# Altium schematic sheet Sheet1.SchDoc
size A; SheetNumber: 1; SheetTotal: 1
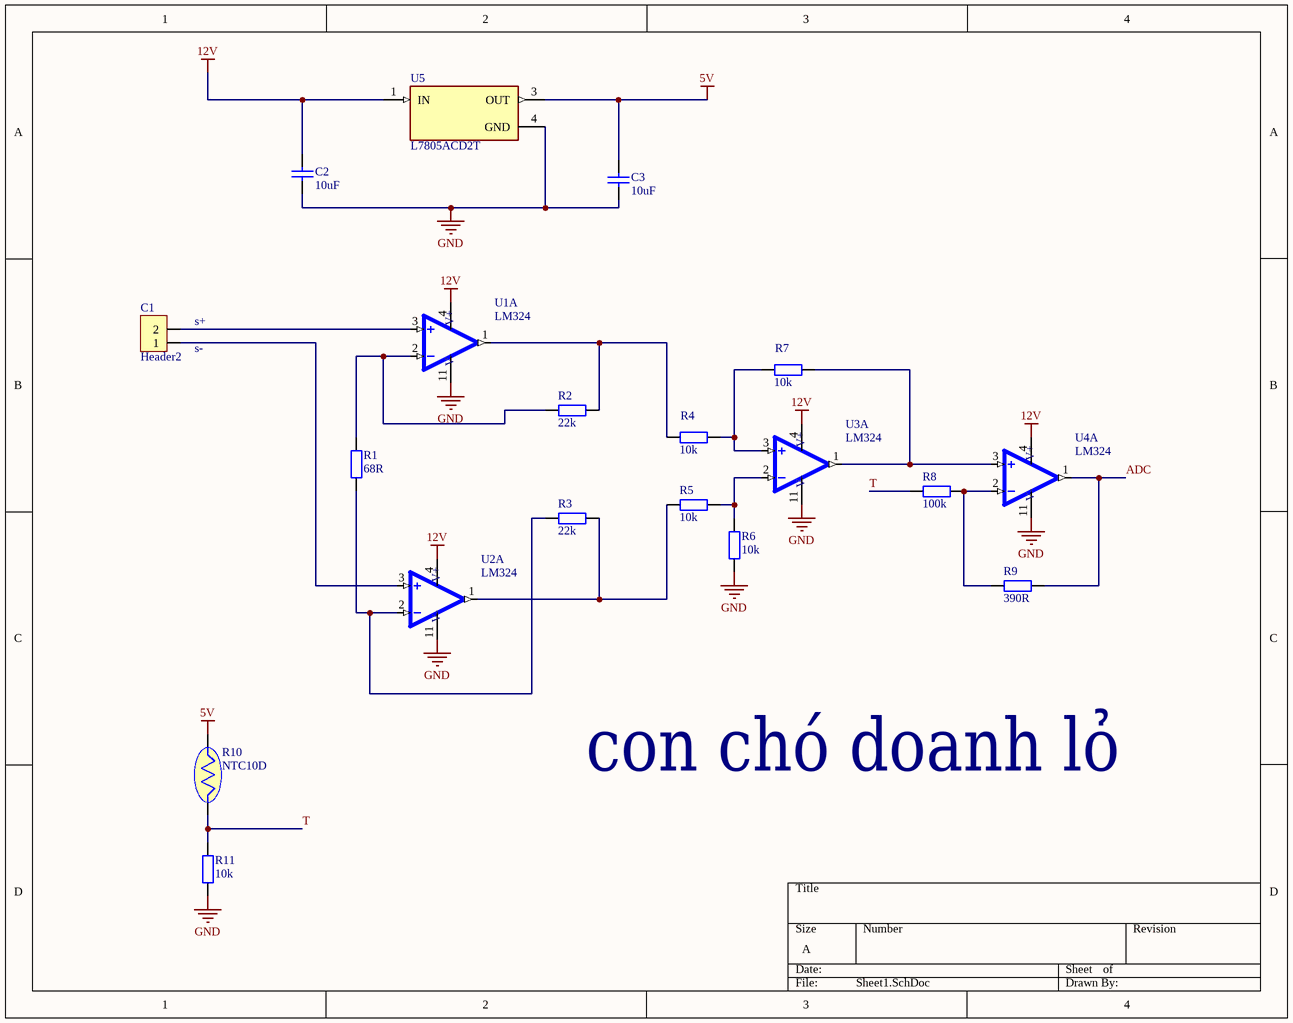
[diagram p0: Sheet1.SchDoc]

## Parts
C1  Header2  [HDR2]
C2  10uF  [tu 0805]
C3  10uF  [tu 0805]
R1  68R  [Tro SMD 0805]
R2  22k  [tro smd 0805]
R3  22k  [tro smd 0805]
R4  10k  [tro smd 0805]
R5  10k  [tro smd 0805]
R6  10k  [tro smd 0805]
R7  10k  [tro smd 0805]
R8  100k  [tro smd 0805]
R9  390R  [Tro SMD 0805]
R10  NTC10D  [NTC10D]
R11  10k  [tro smd 0805]
U1  LM324  [SOIC127P600X175-14N]  (part A of 4)
U2  LM324  [SOIC127P600X175-14N]  (part A of 4)
U3  LM324  [SOIC127P600X175-14N]  (part A of 4)
U4  LM324  [SOIC127P600X175-14N]  (part A of 4)
U5  L7805ACD2T  [VREG_L7805ACD2T]

## Nets
5V: C3.1 R10.2 U5.3(OUT)
12V: C2.1 U1.4(VCC+) U2.4(VCC+) U3.4(VCC+) U4.4(VCC+) U5.1(IN)
GND: C2.2 C3.2 R6.1 R11.1 U1.11(VCC-) U2.11(VCC-) U3.11(VCC-) U4.11(VCC-) U5.4(GND)
ADC: R9.2 U4.1(OUTPUT1)
T: R8.1 R10.1 R11.2
NetC1_1: C1.1 U2.3(NON-INVERTING_INPUT1)
NetC1_2: C1.2 U1.3(NON-INVERTING_INPUT1)
NetR1_1: R1.1 R3.1 U2.2(INVERTING_INPUT1)
NetR1_2: R1.2 R2.1 U1.2(INVERTING_INPUT1)
NetR2_2: R2.2 R4.1 U1.1(OUTPUT1)
NetR3_2: R3.2 R5.1 U2.1(OUTPUT1)
NetR4_2: R4.2 R7.1 U3.3(NON-INVERTING_INPUT1)
NetR5_2: R5.2 R6.2 U3.2(INVERTING_INPUT1)
NetR7_2: R7.2 U3.1(OUTPUT1) U4.3(NON-INVERTING_INPUT1)
NetR8_2: R8.2 R9.1 U4.2(INVERTING_INPUT1)

## Notes on the sheet
- (near C1) s+
- (near C1) s-
- con chó doanh lỏ
- (in symbol LM324, part A) V+; V-

## Library data of the parts
C1 = Header2: Header IDC, 2 x 1 Pin Vertical 2.54mm Pitch (Non-Boxed, Male); Manufacturer: W¨¹rth Elektronik eiSos GmbH; partNo: 613002143121; ComponentLink1 Description: Manufacturer; ComponentLink2 Description: Datasheet; NoPins: 02; Created Date: 29 March 2013; ComponentLink1URL: http://www.we-online.com; ComponentLink2URL: http://katalog.we-online.de/em/datasheet/6130xx143121.pdf; Created by: Karrer Zheng
C2 C3 = Tu 0805 221 50V: Dán; Don_Vi: Con; So_Chan: 2; Ten_Linh_Kien: Tụ 0805 221-220P 50V; Ma_Hang: MH007365; Chung_Loai: Dán; Kieu_Chan: *
R1 = Tro 0805 5% 68R: Dán; Don_Vi: Con; So_Chan: 2; Ten_Linh_Kien: Trở 0805 5% 68R; Ma_Hang: MH005326; Chung_Loai: Dán; Kieu_Chan: *
R2 R3 = Tro 0805 5% 22k: Dán; Don_Vi: Con; So_Chan: 2; Ten_Linh_Kien: Trở 0805 5% 22k; Ma_Hang: MH005248; Chung_Loai: Dán; Kieu_Chan: *
R4-R7 R11 = Tro 0805 5% 10k: Dán; Don_Vi: Con; So_Chan: 2; Ten_Linh_Kien: Trở 0805 5% 10k; Ma_Hang: MH005239; Chung_Loai: Dán; Kieu_Chan: *
R8 = Tro 0805 5% 100k: Dán; Don_Vi: Con; So_Chan: 2; Ten_Linh_Kien: Trở 0805 5% 100k; Ma_Hang: MH005250; Chung_Loai: Dán; Kieu_Chan: *
R9 = Tro 0805 5% 390R: Dán; Don_Vi: Con; So_Chan: 2; Ten_Linh_Kien: Trở 0805 5% 390R; Ma_Hang: MH005339; Chung_Loai: Dán; Kieu_Chan: *
U1-U4 = LM324: Op Amp Quad DÃ¼ÅŸÃ¼k VoltajlÄ± AmplifikatÃ¶r Â±2.75V/5.5V 14-Pin SOIC T/R; MF: Intersil; MP: LM324..; SnapEDA_Link: https://www.snapeda.com/parts/LM324../Intersil/view-part/?ref=snap; Package: None; Value: *; Check_prices: https://www.snapeda.com/parts/LM324../Intersil/view-part/?ref=eda
U5 = L7805ACD2T: Linear Voltage Regulator IC Positive Fixed 1 Output 1.5A D2PAK; MF: STMicroelectronics; SnapEDA_Link: https://www.snapeda.com/parts/L7805ACD2T/STMicroelectronics/view-part/?ref=snap; Package: TO-263-3 STMicroelectronics; Value: *; MP: L7805ACD2T; Check_prices: https://www.snapeda.com/parts/L7805ACD2T/STMicroelectronics/view-part/?ref=eda